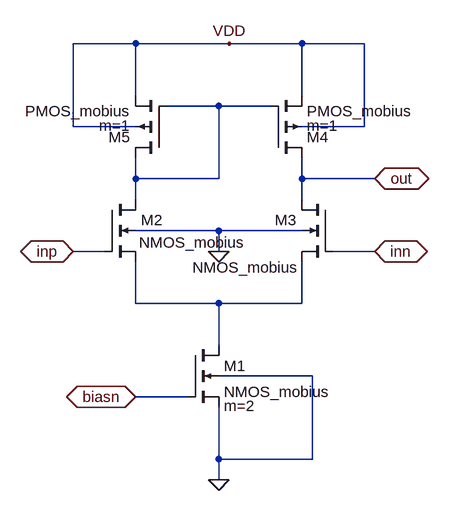
[diagram p0: schematic OTA_nMOS.asc]
OTA_nMOS.asc, the LTspice schematic file:
Version 4
SHEET 1 880 680
WIRE 160 -272 64 -272
WIRE 304 -272 160 -272
WIRE 416 -272 304 -272
WIRE 512 -272 416 -272
WIRE 160 -192 160 -272
WIRE 416 -192 416 -272
WIRE 288 -176 208 -176
WIRE 368 -176 288 -176
WIRE 64 -144 64 -272
WIRE 160 -144 64 -144
WIRE 512 -144 512 -272
WIRE 512 -144 416 -144
WIRE 160 -64 160 -96
WIRE 288 -64 288 -176
WIRE 288 -64 160 -64
WIRE 416 -64 416 -96
WIRE 528 -64 416 -64
WIRE 160 -32 160 -64
WIRE 416 -32 416 -64
WIRE 288 16 160 16
WIRE 416 16 288 16
WIRE 112 48 64 48
WIRE 288 48 288 16
WIRE 528 48 464 48
WIRE 160 128 160 64
WIRE 288 128 160 128
WIRE 416 128 416 64
WIRE 416 128 288 128
WIRE 288 192 288 128
WIRE 432 240 288 240
WIRE 240 272 160 272
WIRE 288 368 288 288
WIRE 432 368 432 240
WIRE 432 368 288 368
WIRE 288 400 288 368
FLAG 160 272 biasn
IOPIN 160 272 BiDir
FLAG 288 400 0
FLAG 288 48 0
FLAG 304 -272 VDD
FLAG 528 -64 out
IOPIN 528 -64 BiDir
FLAG 528 48 inn
IOPIN 528 48 BiDir
FLAG 64 48 inp
IOPIN 64 48 BiDir
SYMBOL nmos4 240 192 R0
WINDOW 123 56 94 Left 2
SYMATTR Value2 m=2
SYMATTR InstName M1
SYMATTR Value NMOS_mobius
SYMBOL nmos4 112 -32 R0
WINDOW 3 53 66 Left 2
SYMATTR InstName M2
SYMATTR Value NMOS_mobius
SYMBOL nmos4 464 -32 M0
WINDOW 3 53 105 Left 2
SYMATTR InstName M3
SYMATTR Value NMOS_mobius
SYMBOL pmos4 368 -96 M180
WINDOW 123 56 50 Left 2
SYMATTR Value2 m=1
SYMATTR InstName M4
SYMATTR Value PMOS_mobius
SYMBOL pmos4 208 -96 R180
WINDOW 123 56 50 Left 2
SYMATTR Value2 m=1
SYMATTR InstName M5
SYMATTR Value PMOS_mobius

The netlist it stands for:
* OTA_nMOS.asc
M1 N002 biasn 0 0 NMOS_mobius m=2
M2 N001 inp N002 0 NMOS_mobius
M3 out inn N002 0 NMOS_mobius
M4 out N001 VDD VDD PMOS_mobius m=1
M5 N001 N001 VDD VDD PMOS_mobius m=1
.model NMOS NMOS
.model PMOS PMOS
.lib standard.mos
.backanno
.end